# EAGLE design quadcopter (EAGLE 7.2.0)
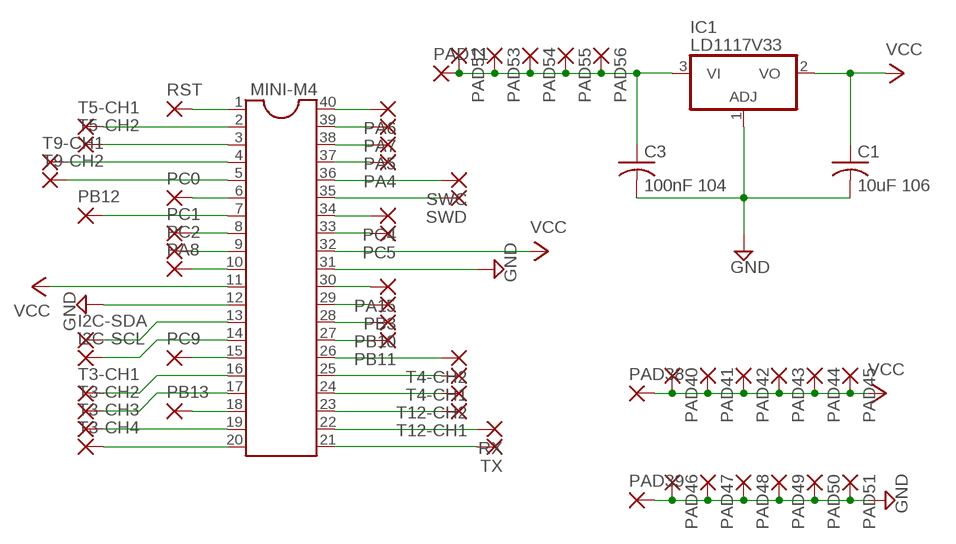
[diagram p0: schematic, sheet 1]

## Parts
C1  10uF 106  C-US025-040X050  [C025-040X050]
C3  100nF 104  C-US025-040X050  [C025-040X050]
I2C-SCL  1,6/0,8  [1,6/0,8]
I2C-SDA  1,6/0,8  [1,6/0,8]
IC1  LD1117V33  317T  [TO220H]
MINI-M4  DIL40  [DIL40]
PA4  1,6/0,8  [1,6/0,8]
PA5  1,6/0,8  [1,6/0,8]
PA6  1,6/0,8  [1,6/0,8]
PA7  1,6/0,8  [1,6/0,8]
PA8  1,6/0,8  [1,6/0,8]
PA15  1,6/0,8  [1,6/0,8]
PAD11  1,6/0,8  [1,6/0,8]
PAD38  1,6/0,8  [1,6/0,8]
PAD39  1,6/0,8  [1,6/0,8]
PAD40  1,6/0,8  [1,6/0,8]
PAD41  1,6/0,8  [1,6/0,8]
PAD42  1,6/0,8  [1,6/0,8]
PAD43  1,6/0,8  [1,6/0,8]
PAD44  1,6/0,8  [1,6/0,8]
PAD45  1,6/0,8  [1,6/0,8]
PAD46  1,6/0,8  [1,6/0,8]
PAD47  1,6/0,8  [1,6/0,8]
PAD48  1,6/0,8  [1,6/0,8]
PAD49  1,6/0,8  [1,6/0,8]
PAD50  1,6/0,8  [1,6/0,8]
PAD51  1,6/0,8  [1,6/0,8]
PAD52  1,6/0,8  [1,6/0,8]
PAD53  1,6/0,8  [1,6/0,8]
PAD54  1,6/0,8  [1,6/0,8]
PAD55  1,6/0,8  [1,6/0,8]
PAD56  1,6/0,8  [1,6/0,8]
PB3  1,6/0,8  [1,6/0,8]
PB10  1,6/0,8  [1,6/0,8]
PB11  1,6/0,8  [1,6/0,8]
PB12  1,6/0,8  [1,6/0,8]
PB13  1,6/0,8  [1,6/0,8]
PC0  1,6/0,8  [1,6/0,8]
PC1  1,6/0,8  [1,6/0,8]
PC2  1,6/0,8  [1,6/0,8]
PC4  1,6/0,8  [1,6/0,8]
PC5  1,6/0,8  [1,6/0,8]
PC9  1,6/0,8  [1,6/0,8]
RST  1,6/0,8  [1,6/0,8]
RX  1,6/0,8  [1,6/0,8]
SWC  1,6/0,8  [1,6/0,8]
SWD  1,6/0,8  [1,6/0,8]
T3-CH1  1,6/0,8  [1,6/0,8]
T3-CH2  1,6/0,8  [1,6/0,8]
T3-CH3  1,6/0,8  [1,6/0,8]
T3-CH4  1,6/0,8  [1,6/0,8]
T4-CH1  1,6/0,8  [1,6/0,8]
T4-CH2  1,6/0,8  [1,6/0,8]
T5-CH1  1,6/0,8  [1,6/0,8]
T5-CH2  1,6/0,8  [1,6/0,8]
T9-CH1  1,6/0,8  [1,6/0,8]
T9-CH2  1,6/0,8  [1,6/0,8]
T12-CH1  1,6/0,8  [1,6/0,8]
T12-CH2  1,6/0,8  [1,6/0,8]
TX  1,6/0,8  [1,6/0,8]

## Nets
GND: C1.2 C3.2 IC1.1(ADJ) MINI-M4.12 MINI-M4.31 PAD39.1(P) PAD46.1(P) PAD47.1(P) PAD48.1(P) PAD49.1(P) PAD50.1(P) PAD51.1(P)
N$1: MINI-M4.2 T5-CH1.1(P)
N$2: MINI-M4.1 RST.1(P)
N$3: MINI-M4.3 T5-CH2.1(P)
N$4: MINI-M4.4 T9-CH1.1(P)
N$5: MINI-M4.6 PC0.1(P)
N$6: MINI-M4.5 T9-CH2.1(P)
N$7: MINI-M4.7 PB12.1(P)
N$8: MINI-M4.8 PC1.1(P)
N$9: MINI-M4.9 PC2.1(P)
N$10: MINI-M4.10 PA8.1(P)
N$11: MINI-M4.16 T3-CH1.1(P)
N$12: MINI-M4.17 T3-CH2.1(P)
N$13: I2C-SDA.1(P) MINI-M4.13
N$14: I2C-SCL.1(P) MINI-M4.14
N$15: C3.1 IC1.3(VI) PAD11.1(P) PAD52.1(P) PAD53.1(P) PAD54.1(P) PAD55.1(P) PAD56.1(P)
N$16: MINI-M4.15 PC9.1(P)
N$17: MINI-M4.40 PA6.1(P)
N$18: MINI-M4.18 PB13.1(P)
N$19: MINI-M4.19 T3-CH3.1(P)
N$20: MINI-M4.20 T3-CH4.1(P)
N$21: MINI-M4.39 PA7.1(P)
N$23: MINI-M4.37 PA4.1(P)
N$24: MINI-M4.38 PA5.1(P)
N$25: MINI-M4.36 SWC.1(P)
N$26: MINI-M4.35 SWD.1(P)
N$27: MINI-M4.33 PC5.1(P)
N$28: MINI-M4.34 PC4.1(P)
N$31: MINI-M4.30 PA15.1(P)
N$32: MINI-M4.29 PB3.1(P)
N$33: MINI-M4.28 PB10.1(P)
N$34: MINI-M4.26 T4-CH2.1(P)
N$35: MINI-M4.27 PB11.1(P)
N$36: MINI-M4.25 T4-CH1.1(P)
N$37: MINI-M4.24 T12-CH2.1(P)
N$38: MINI-M4.22 RX.1(P)
N$39: MINI-M4.23 T12-CH1.1(P)
N$40: MINI-M4.21 TX.1(P)
VCC: C1.1 IC1.2(VO) MINI-M4.11 MINI-M4.32 PAD38.1(P) PAD40.1(P) PAD41.1(P) PAD42.1(P) PAD43.1(P) PAD44.1(P) PAD45.1(P)

## Library data of the parts
C1 C3 = rcl:C-US: CAPACITOR, American symbol
I2C-SCL I2C-SDA PA4-PA8 PA15 PAD11 PAD38-PAD56 PB3 PB10-PB13 PC0 PC1 PC2 PC4 PC5 PC9 RST RX SWC SWD T3-CH1-T3-CH4 T4-CH1 T4-CH2 T5-CH1 T5-CH2 T9-CH1 T9-CH2 T12-CH1 T12-CH2 TX = wirepad:1,6/0,8: THROUGH-HOLE PAD
IC1 = linear:*317: Positive VOLTAGE REGULATOR
MINI-M4 = ic-package:DIL40: Dual In Line

## Board
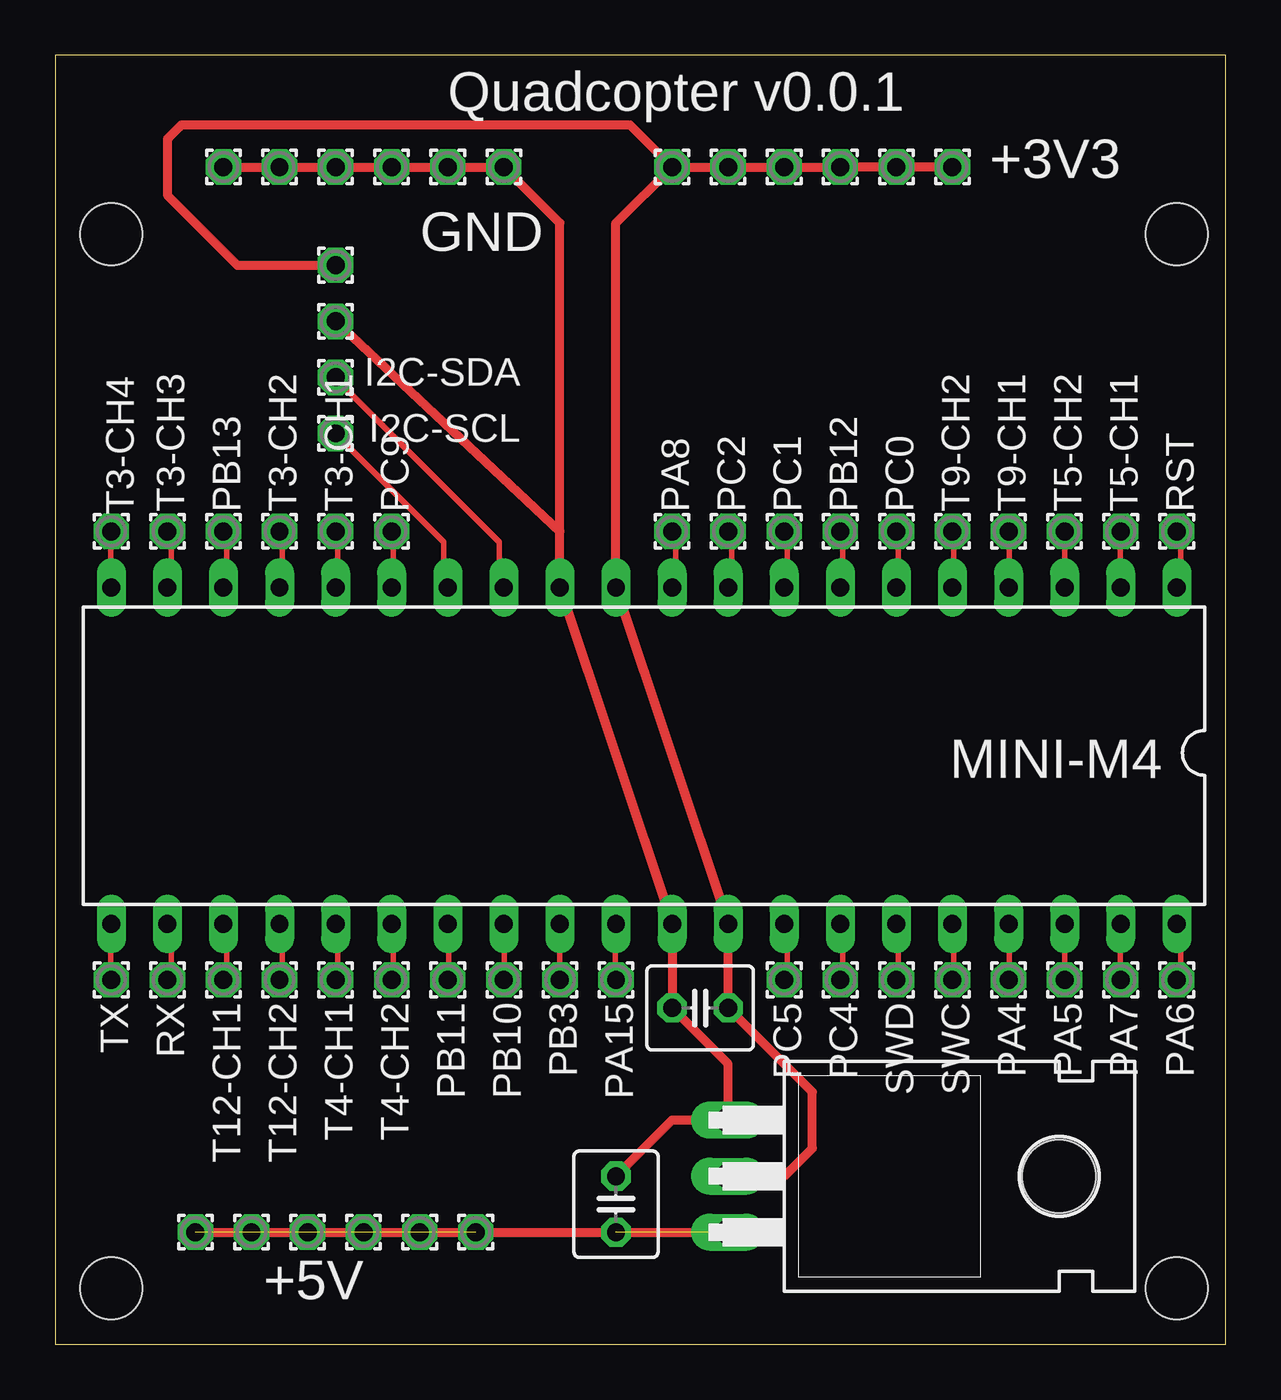
[diagram p1: board, top side]

Size 53.01 x 58.41 mm. Coordinates in mm from the lower left corner, seen from the top.
Outline: 0,0 53.01,0 53.01,58.41 0,58.41 0,0
Copper layers (1*16): Top 0.035mm / dielectric 1.5mm / Bottom 0.035mm
Design rules "default": minimum track width 10mil, minimum drill 24mil, track to track 8mil, track to pad 8mil, pad to pad 8mil, via to via 8mil, smd to smd 8mil, copper to edge 40mil, drill to drill 8mil, minimum pad ring 10mil, minimum via ring 8mil, stop-mask expansion 4mil, vias tented up to drill 0mil, thermal gap 10mil
Holes 2.8 mm at 2.54,50.29 50.8,50.29 50.8,2.54 2.54,2.54

### Footprints (pad centres in the part's own frame; a part is rotated, then mirrored left to right if it is on the bottom)
C025-040X050 = drill 0.813 octagon: 1 -1.27,0; 2 1.27,0
1,6/0,8 = drill 0.813 pad 1.6 octagon: 1 0,0
TO220H = drill 1.118 long: 1 -2.54,-10.16; 2 0,-10.16; 3 2.54,-10.16 | hole 3.302: 0,4.826
DIL40 = drill 0.813 long: 1 -24.13,-7.62; 2 -21.59,-7.62; 3 -19.05,-7.62; 4 -16.51,-7.62; 5 -13.97,-7.62; 6 -11.43,-7.62; 7 -8.89,-7.62; 8 -6.35,-7.62; 9 -3.81,-7.62; 10 -1.27,-7.62; 11 1.27,-7.62; 12 3.81,-7.62; 13 6.35,-7.62; 14 8.89,-7.62; 15 11.43,-7.62; 16 13.97,-7.62; 17 16.51,-7.62; 18 19.05,-7.62; 19 21.59,-7.62; 20 24.13,-7.62; 21 24.13,7.62; 22 21.59,7.62; 23 19.05,7.62; 24 16.51,7.62; 25 13.97,7.62; 26 11.43,7.62; 27 8.89,7.62; 28 6.35,7.62; 29 3.81,7.62; 30 1.27,7.62; 31 -1.27,7.62; 32 -3.81,7.62; 33 -6.35,7.62; 34 -8.89,7.62; 35 -11.43,7.62; 36 -13.97,7.62; 37 -16.51,7.62; 38 -19.05,7.62; 39 -21.59,7.62; 40 -24.13,7.62

### Placement (x,y rotation side)
C1  29.21,15.24 180 top
C3  25.4,6.35 90 top
I2C-SCL  12.7,41.27 180 top
I2C-SDA  12.7,43.81 180 top
IC1  40.64,7.62 270 top
MINI-M4  26.67,26.67 180 top
PA4  43.18,16.51 180 top
PA5  45.72,16.51 180 top
PA6  50.8,16.51 180 top
PA7  48.26,16.51 180 top
PA8  27.94,36.83 180 top
PA15  25.4,16.51 180 top
PAD11  13.97,5.08 0 top
PAD38  30.48,53.34 270 top
PAD39  12.7,46.35 270 top
PAD40  27.94,53.34 270 top
PAD41  12.7,48.9 270 top
PAD42  33.02,53.34 270 top
PAD43  35.56,53.34 270 top
PAD44  38.1,53.34 270 top
PAD45  40.64,53.34 270 top
PAD46  20.32,53.34 270 top
PAD47  17.78,53.34 270 top
PAD48  15.24,53.34 270 top
PAD49  12.7,53.34 270 top
PAD50  10.16,53.34 270 top
PAD51  7.62,53.34 270 top
PAD52  6.35,5.08 0 top
PAD53  11.43,5.08 0 top
PAD54  8.89,5.08 0 top
PAD55  19.05,5.08 0 top
PAD56  16.51,5.08 0 top
PB3  22.86,16.51 180 top
PB10  20.32,16.51 180 top
PB11  17.78,16.51 180 top
PB12  35.56,36.83 180 top
PB13  7.62,36.83 180 top
PC0  38.1,36.83 180 top
PC1  33.02,36.83 180 top
PC2  30.48,36.83 180 top
PC4  35.56,16.51 180 top
PC5  33.02,16.51 180 top
PC9  15.24,36.83 180 top
RST  50.8,36.83 180 top
RX  5.08,16.51 180 top
SWC  40.64,16.51 180 top
SWD  38.1,16.51 180 top
T3-CH1  12.7,36.83 180 top
T3-CH2  10.16,36.83 180 top
T3-CH3  5.08,36.83 180 top
T3-CH4  2.54,36.83 270 top
T4-CH1  12.7,16.51 180 top
T4-CH2  15.24,16.51 180 top
T5-CH1  48.26,36.83 180 top
T5-CH2  45.72,36.83 180 top
T9-CH1  43.18,36.83 180 top
T9-CH2  40.64,36.83 180 top
T12-CH1  7.62,16.51 180 top
T12-CH2  10.16,16.51 180 top
TX  2.54,16.51 180 top

### Tracks (layer width: path | path; a pad name or v marks a point on that pad's centre or on a via)
GND
  Top 0.254: 17.83,53.37 PAD47.1 | 12.8,53.37 PAD49.1 | 12.57,53.37 PAD49.1 | 10.29,53.37 PAD50.1 10.06,53.26 10.06,53.34 | 17.6,53.37 PAD47.1 | 17.6,53.26 PAD47.1 | 17.6,53.34 17.6,53.49 PAD47.1 | 12.8,53.34 12.8,53.49 PAD49.1
  Top 0.406: 22.86,36.83 MINI-M4.12 MINI-M4.31 C1.2 30.48,12.7 IC1.1 27.94,10.16 C3.2 | 22.86,36.83 22.86,50.8 PAD46.1 PAD47.1 17.6,53.34 PAD48.1 12.8,53.34 PAD49.1 PAD50.1 10.06,53.34 PAD51.1 | PAD39.1 22.86,36.83
N$1
  Top 0.254: MINI-M4.2 48.23,34.29 48.23,36.8 T5-CH1.1
N$2
  Top 0.254: MINI-M4.1 50.98,34.29 50.98,36.8 RST.1
N$3
  Top 0.254: T5-CH2.1 MINI-M4.3
N$4
  Top 0.254: MINI-M4.4 43.2,34.29 43.2,36.8 T9-CH1.1
N$5
  Top 0.254: MINI-M4.6 38.18,34.29 38.18,36.8 PC0.1
N$6
  Top 0.254: MINI-M4.5 40.69,34.29 40.69,36.8 T9-CH2.1
N$7
  Top 0.254: MINI-M4.7 35.66,34.29 35.66,36.8 PB12.1
N$8
  Top 0.254: MINI-M4.8 33.15,34.29 33.15,36.8 PC1.1
N$9
  Top 0.254: MINI-M4.9 30.63,34.29 30.63,36.8 PC2.1
N$10
  Top 0.254: MINI-M4.10 28.12,34.29 28.12,36.8 PA8.1
N$11
  Top 0.254: MINI-M4.16 12.8,34.29 12.8,36.8 T3-CH1.1
N$12
  Top 0.254: MINI-M4.17 10.29,34.29 10.29,36.8 T3-CH2.1
N$13
  Top 0.254: MINI-M4.13 20.12,34.29 20.12,36.35 12.8,43.66 I2C-SDA.1
N$14
  Top 0.254: MINI-M4.14 17.6,34.29 17.6,36.35 12.8,41.15 I2C-SCL.1
N$15  (6 unrouted)
  Top 0.406: PAD52.1 IC1.3
N$16
  Top 0.254: MINI-M4.15 15.32,34.29 15.32,36.8 PC9.1
N$17
  Top 0.254: MINI-M4.40 50.98,18.97 50.98,16.69 PA6.1
N$18
  Top 0.254: MINI-M4.18 7.77,34.29 7.77,36.8 PB13.1
N$19
  Top 0.254: MINI-M4.19 5.26,34.29 5.26,36.8 T3-CH3.1
N$20
  Top 0.254: MINI-M4.20 2.52,34.29 2.52,36.8 T3-CH4.1
N$21
  Top 0.254: MINI-M4.39 48.23,18.97 48.23,16.69 PA7.1
N$23
  Top 0.254: MINI-M4.37 43.2,18.97 43.2,16.69 PA4.1
N$24
  Top 0.254: PA5.1 MINI-M4.38
N$25
  Top 0.254: MINI-M4.36 40.69,18.97 40.69,16.69 SWC.1
N$26
  Top 0.254: MINI-M4.35 38.18,18.97 38.18,16.69 SWD.1
N$27
  Top 0.254: MINI-M4.33 33.15,18.97 33.15,16.69 PC5.1
N$28
  Top 0.254: MINI-M4.34 35.66,18.97 35.66,16.69 PC4.1
N$31
  Top 0.254: MINI-M4.30 25.38,18.97 25.38,16.69 PA15.1
N$32
  Top 0.254: PB3.1 MINI-M4.29
N$33
  Top 0.254: MINI-M4.28 20.34,18.97 20.34,16.69 PB10.1
N$34
  Top 0.254: MINI-M4.26 15.32,18.97 15.32,16.69 T4-CH2.1
N$35
  Top 0.254: MINI-M4.27 17.83,18.97 17.83,16.69 PB11.1
N$36
  Top 0.254: MINI-M4.25 12.8,18.97 12.8,16.69 T4-CH1.1
N$37
  Top 0.254: MINI-M4.24 10.29,18.97 10.29,16.69 T12-CH2.1
N$38
  Top 0.254: MINI-M4.22 5.26,18.97 5.26,16.69 RX.1
N$39
  Top 0.254: MINI-M4.23 7.77,18.97 7.77,16.69 T12-CH1.1
N$40
  Top 0.254: MINI-M4.21 2.52,18.97 2.52,16.69 TX.1
VCC
  Top 0.254: 35.66,53.37 PAD43.1 | 37.95,53.37 PAD44.1 | 40.46,53.37 PAD45.1 | PAD44.1 38.18,53.37 38.18,53.26 PAD44.1 | 30.4,53.37 PAD38.1 | 32.92,53.37 PAD42.1 | 30.63,53.37 PAD38.1 | 35.43,53.37 PAD43.1 | 33.15,53.37 PAD42.1 | PAD42.1 33.15,53.26 35.43,53.26 PAD43.1 | 35.66,53.26 PAD43.1 | 37.95,53.26 PAD44.1 | PAD38.1 30.4,53.26 30.4,53.34
  Top 0.406: PAD40.1 30.4,53.34 PAD38.1 PAD43.1 | 35.66,53.37 38.18,53.37 40.62,53.37 PAD45.1 | PAD40.1 26.04,55.24 5.71,55.24 5.08,54.61 5.08,52.07 8.26,48.9 PAD41.1 | PAD40.1 25.4,50.8 MINI-M4.11 MINI-M4.32 C1.1 34.29,11.43 34.29,8.89 33.02,7.62 IC1.2

### Text on the board
tPlace: Quadcopter v0.0.1 | +3V3 | GND | +5V